# Altium schematic sheet Led_Master.SchDoc
size A3; SheetNumber: 1; SheetTotal: 1; SPICEModelCacheZWRPGDZJ: <root> / <DocumentId>ZWRPGDZJ</DocumentId> / </root>
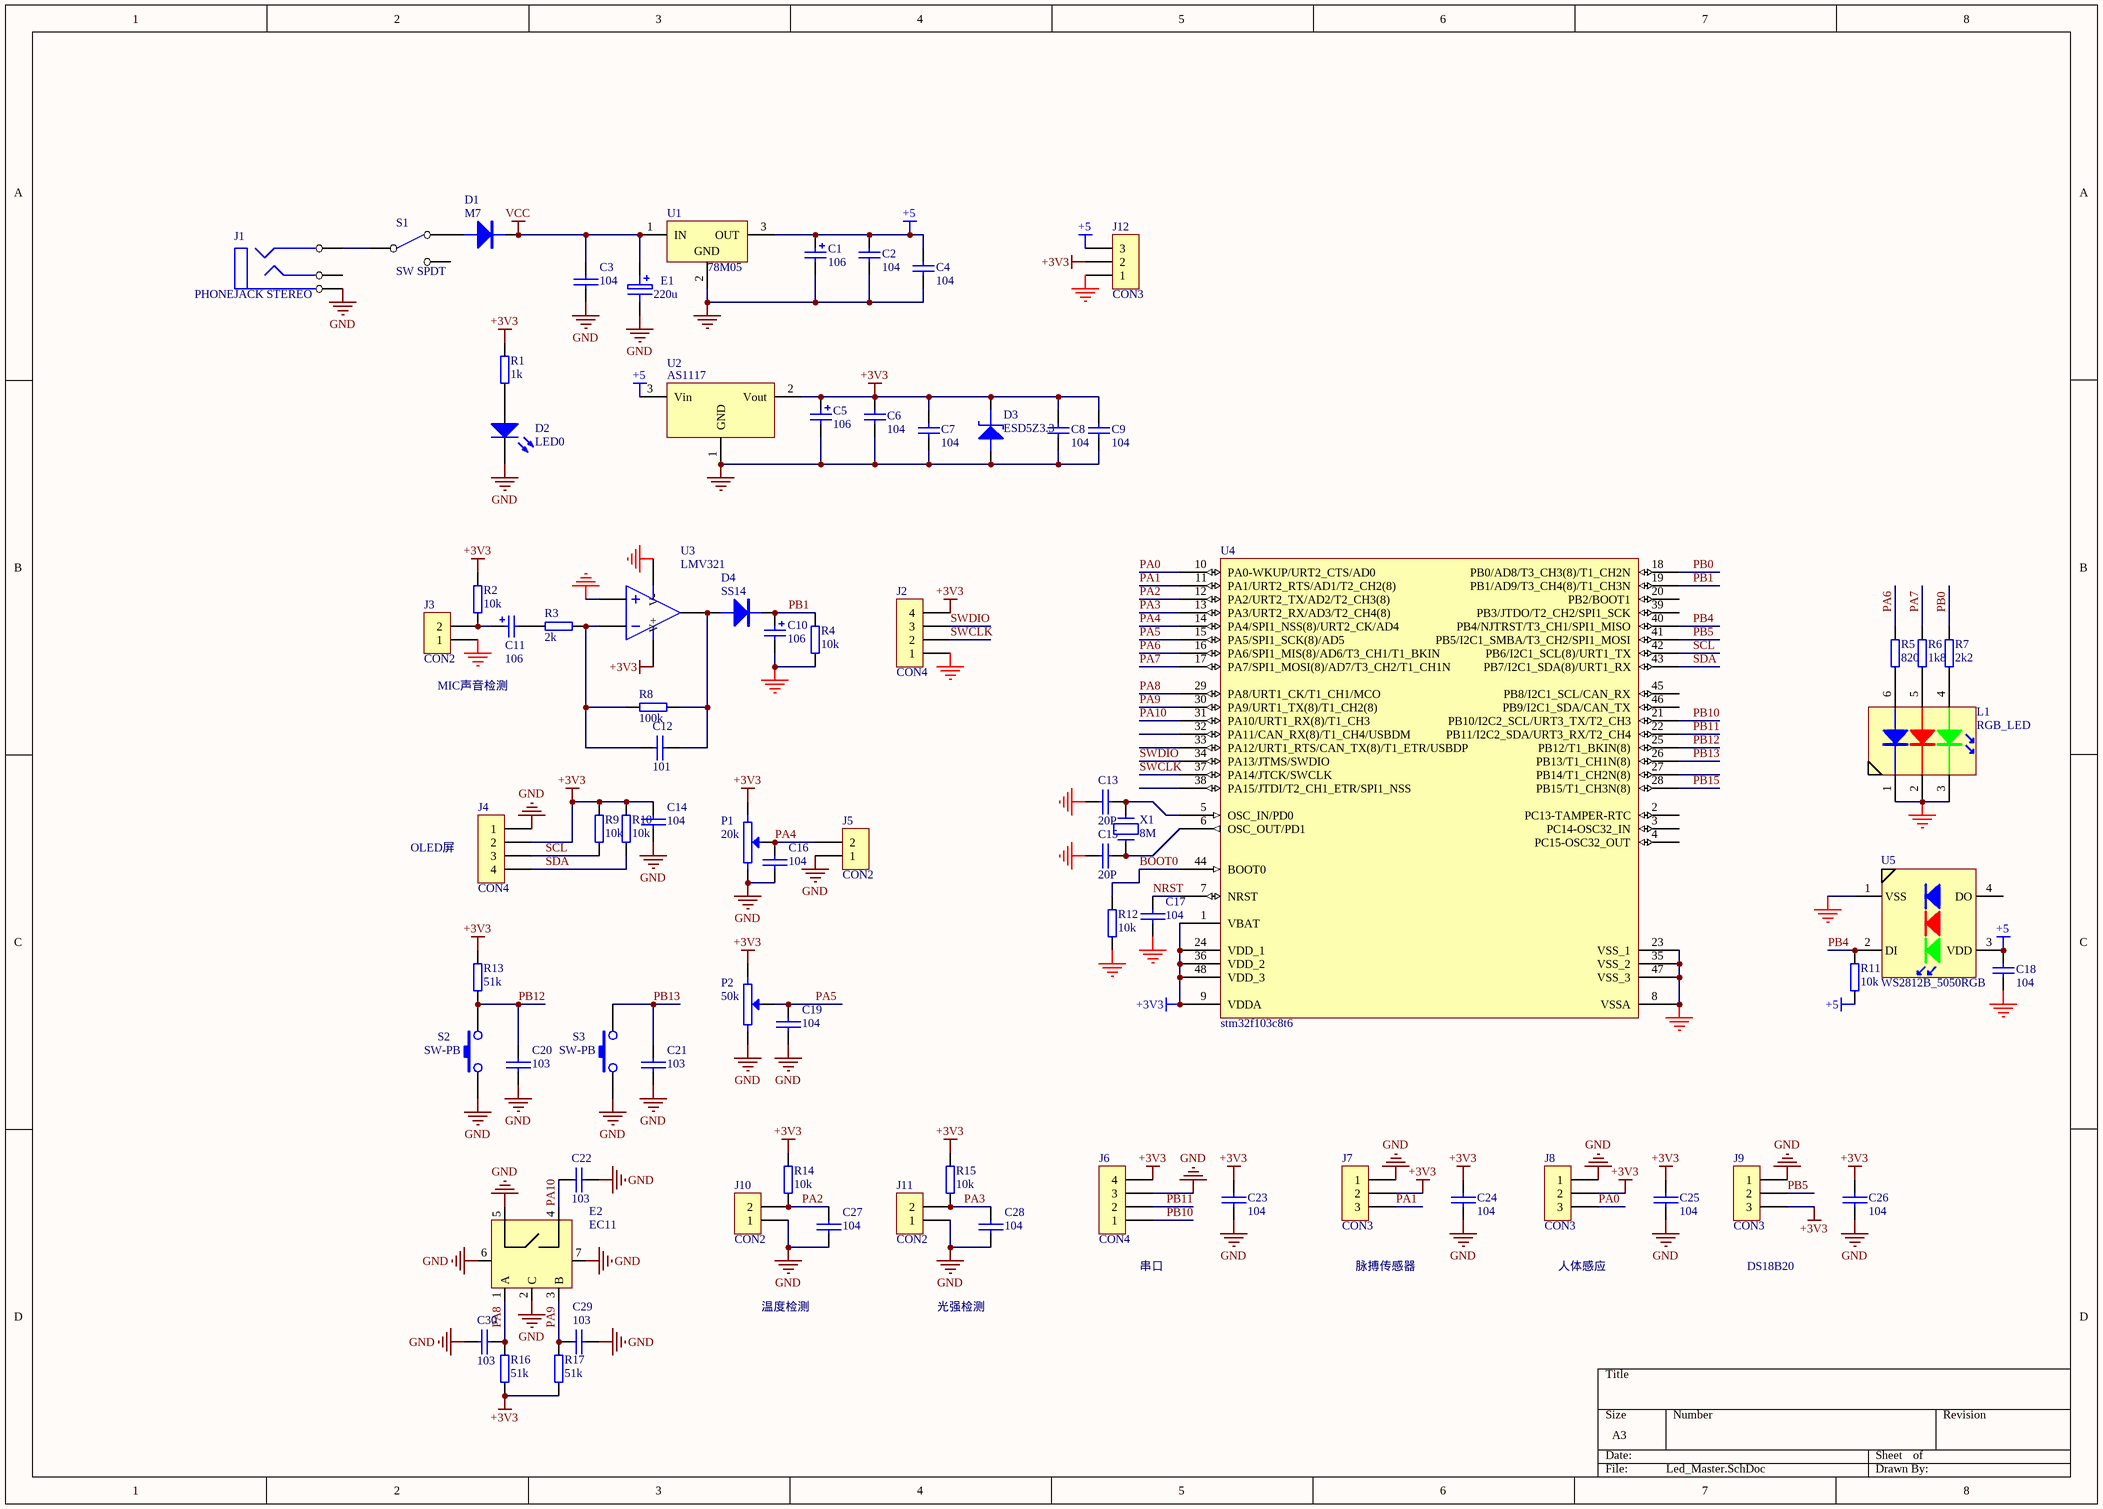
[diagram p0: Led_Master.SchDoc]

## Parts
C1  106  [0603C]
C2  104  [0603C]
C3  104  [0603c]
C4  104  [0603C]
C5  106  [0603C]
C6  104  [0603C]
C7  104  [0603C]
C8  104  [0603C]
C9  104  [0603C]
C10  106  [0603C]
C11  106  [0603C]
C12  101  [0603c]
C13  20P  [0603c]
C14  104  [0603c]
C15  20P  [0603c]
C16  104  [0603c]
C17  104  [0603c]
C18  104  [0603C]
C19  104  [0603c]
C20  103  [0603c]
C21  103  [0603c]
C22  103  [0603c]
C23  104  [0603c]
C24  104  [0603c]
C25  104  [0603c]
C26  104  [0603c]
C27  104  [0603c]
C28  104  [0603c]
C29  103  [0603c]
C30  103  [0603c]
D1  M7  [DO214_SMA]
D2  LED0  [LED_0805_R]
D3  ESD5Z3.3  [SOD323]
D4  SS14  [SOD123]
E1  220u  [CAP_PR_2.5_8]
E2  EC11  [SW_EC11]
J1  PHONEJACK STEREO  [内径5.5插座]
J2  CON4  [SIP4]
J3  CON2  [SIP02]
J4  CON4  [OLED 1.3寸屏]
J5  CON2  [SIP02]
J6  CON4  [XH_2.54_4P]
J7  CON3  [SIP03]
J8  CON3  [SIP03]
J9  CON3  [SIP03]
J10  CON2  [SIP02]
J11  CON2  [SIP02]
J12  CON3  [SIP03]
L1  RGB_LED  [LED_5050]
P1  20k  [RV0932]
P2  50k  [RV0932]
R1  1k  [0603r]
R2  10k  [0603r]
R3  2k  [0603r]
R4  10k  [0603r]
R5  820  [0603r]
R6  1k8  [0603r]
R7  2k2  [0603r]
R8  100k  [0603r]
R9  10k  [0603r]
R10  10k  [0603r]
R11  10k  [0603r]
R12  10k  [0603r]
R13  51k  [0603r]
R14  10k  [0603r]
R15  10k  [0603r]
R16  51k  [0603r]
R17  51k  [0603r]
S1  SW SPDT  [SS12D10直脚拨动开关]
S2  SW-PB  [SW_PB_6X6]
S3  SW-PB  [SW_PB_6X6]
U1  78M05  [TO-252AA]
U2  AS1117  [SOT223]
U3  LMV321  [SOT23_5]
U4  stm32f103c8t6  [LQFP_48_7X7]
U5  WS2812B_5050RGB  [LED_5050]
X1  8M  [CAPM5032X12N]

## Nets
+3V3: C5.1 C6.1 C7.1 C8.1 C9.1 C14.1 C23.2 C24.2 C25.2 C26.2 D3.2(K) J2.4 J4.2 J6.4 J7.2 J8.2 J9.3 J12.2 P1.2 P2.2 R1.2 R2.2 R9.2 R10.2 R13.2 R14.2 R15.2 R16.1 R17.1 U2.2(Vout) U3.4(V+) U4.1(VBAT) U4.9(VDDA) U4.24(VDD_1) U4.36(VDD_2) U4.48(VDD_3)
+5: C1.1 C2.1 C4.1 C18.1 J12.3 R11.2 U1.3(OUT) U2.3(Vin) U5.3(VDD)
GND: C1.2 C2.2 C3.2 C4.2 C5.2 C6.2 C7.2 C8.2 C9.2 C10.2 C13.1 C14.2 C15.1 C16.2 C17.2 C18.2 C19.2 C20.2 C21.2 C22.2 C23.1 C24.1 C25.1 C26.1 C27.2 C28.2 C29.2 C30.1 D2.2(K) D3.1(A) E1.2 E2.2(C) E2.5 E2.6 E2.7 J1.3(C) J2.1 J3.1 J4.1 J5.1 J6.3 J7.1 J8.1 J9.1 J10.1 J11.1 J12.1 L1.1 L1.2 L1.3 P1.1 P2.1 R4.1 R12.1 S2.1 S3.1 U1.2(GND) U2.1(GND) U3.2(IN+) U3.5(V-) U4.8(VSSA) U4.23(VSS_1) U4.35(VSS_2) U4.47(VSS_3) U5.1(VSS)
VCC: C3.1 D1.2(K) E1.1 U1.1(IN)
BOOT0: R12.2 U4.44(BOOT0)
NRST: C17.1 U4.7(NRST)
PA0: J8.3 U4.10(PA0-WKUP/URT2_CTS/AD0)
PA1: J7.3 U4.11(PA1/URT2_RTS/AD1/T2_CH2(8))
PA2: C27.1 J10.2 R14.1 U4.12(PA2/URT2_TX/AD2/T2_CH3(8))
PA3: C28.1 J11.2 R15.1 U4.13(PA3/URT2_RX/AD3/T2_CH4(8))
PA4: C16.1 J5.2 P1.3(W) U4.14(PA4/SPI1_NSS(8)/URT2_CK/AD4)
PA5: C19.1 P2.3(W) U4.15(PA5/SPI1_SCK(8)/AD5)
PA6: R5.2 U4.16(PA6/SPI1_MIS(8)/AD6/T3_CH1/T1_BKIN)
PA7: R6.2 U4.17(PA7/SPI1_MOSI(8)/AD7/T3_CH2/T1_CH1N)
PA8: C30.2 E2.1(A) R16.2 U4.29(PA8/URT1_CK/T1_CH1/MCO)
PA9: C29.1 E2.3(B) R17.2 U4.30(PA9/URT1_TX(8)/T1_CH2(8))
PA10: C22.1 E2.4 U4.31(PA10/URT1_RX(8)/T1_CH3)
PB0: R7.2 U4.18(PB0/AD8/T3_CH3(8)/T1_CH2N)
PB1: C10.1 D4.2(K) R4.2 U4.19(PB1/AD9/T3_CH4(8)/T1_CH3N)
PB4: R11.1 U4.40(PB4/NJTRST/T3_CH1/SPI1_MISO) U5.2(DI)
PB5: J9.2 U4.41(PB5/I2C1_SMBA/T3_CH2/SPI1_MOSI)
PB10: J6.1 U4.21(PB10/I2C2_SCL/URT3_TX/T2_CH3)
PB11: J6.2 U4.22(PB11/I2C2_SDA/URT3_RX/T2_CH4)
PB12: C20.1 R13.1 S2.2 U4.25(PB12/T1_BKIN(8))
PB13: C21.1 S3.2 U4.26(PB13/T1_CH1N(8))
PB15: U4.28(PB15/T1_CH3N(8))
SCL: J4.3 R9.1 U4.42(PB6/I2C1_SCL(8)/URT1_TX)
SDA: J4.4 R10.1 U4.43(PB7/I2C1_SDA(8)/URT1_RX)
SWCLK: J2.2 U4.37(PA14/JTCK/SWCLK)
SWDIO: J2.3 U4.34(PA13/JTMS/SWDIO)
NetC11_1: C11.1 J3.2 R2.1
NetC11_2: C11.2 R3.1
NetC12_1: C12.1 D4.1(A) R8.1 U3.3(OUT)
NetC12_2: C12.2 R3.2 R8.2 U3.1(IN-)
NetC13_2: C13.2 U4.5(OSC_IN/PD0) X1.2
NetC15_2: C15.2 U4.6(OSC_OUT/PD1) X1.1
NetD1_1: D1.1(A) S1.2(NC)
NetD2_1: D2.1(A) R1.1
NetJ1_1: J1.1(A) S1.1(COMMON)
NetL1_4: L1.4 R7.1
NetL1_5: L1.5 R6.1
NetL1_6: L1.6 R5.1

Not connected (* = marked no-connect by the designer): J1 2(B); L1 A(1); S1 3(NO); U4 2(PC13-TAMPER-RTC) 3(PC14-OSC32_IN) 4(PC15-OSC32_OUT) 20(PB2/BOOT1) 27(PB14/T1_CH2N(8)) 32(PA11/CAN_RX(8)/T1_CH4/USBDM) 33(PA12/URT1_RTS/CAN_TX(8)/T1_ETR/USBDP) 38(PA15/JTDI/T2_CH1_ETR/SPI1_NSS) 39(PB3/JTDO/T2_CH2/SPI1_SCK) 45(PB8/I2C1_SCL/CAN_RX) 46(PB9/I2C1_SDA/CAN_TX); U5 4(DO) A(1)

## Notes on the sheet
- MIC声音检测
- OLED屏
- 温度检测
- 光强检测
- (near J6) 串口
- 脉搏传感器
- 人体感应
- DS18B20

## Library data of the parts
C1 C5 C10 C11 = Cap Pol1: Polarized Capacitor (Radial); Value: 10uF; Published: 8-Jun-2000; Revision: July-2002: Re-released for DXP Platform.; Publisher: Altium Limited
C2 C4 C6-C9 C18 = Cap: Capacitor; Value: 10nF; Published: 8-Jun-2000; Revision: July-2002: Re-released for DXP Platform.; Publisher: Altium Limited
C3 C14 C16 C19-C22 C27-C30 = Pro14.tmp_104_7
C12 C17 C23-C26 = CAP: Capacitor
C13 C15 = Pro87.tmp_22p_18
D1 D4 = DIODE
D2 = LED0: Typical INFRARED GaAs LED; pin to pad: 1>2 2>1; Published: 8-Jun-2000; LatestRevisionDate: 08-Jul-2005; LatestRevisionNote: Mech Layer 1 removed.; PackageReference: LED-0; Publisher: Altium Limited
D3 = ZENER2: Zener Diode
E1 = Pro87.tmp_47u_10
E2 = EC11编码开关: pin to pad: 6>H1 7>H2
J1 = PHONEJACK STEREO: pin to pad: 2>3 3>2
J2 J4 J6 = CON4: Connector
J3 J5 J10 J11 = CON2: Connector
J7-J9 J12 = CON3: Connector
P1 P2 = POT2: Potentiometer; pin to pad: 2>3 3>2
R1-R17 = RES2
U1 = LP2950CDT-5.0: Series of Adjustable Micropower Voltage Regulators; Manufacturer: National Semiconductor; CompType: LDO IC; PackageTopMarking: NSUZXYTT*LP2950*CDT-5.0; PowerWise: N; Published: 4-Dec-2008; DatasheetVersion: May-2005; PackageVersion: revC, Apr-2003; PackageReference: TD03B; Publisher: Altium Limited; PackageDescription: TO252, Molded, Jedec, 6.8 x 6.10 x 2.30mm Body, 3 Lead, 2.28mm Pitch, Surface Mount; PartNumber: LP2950CDT-5.0; RoHS: O; PinCount: 3; DigiKeyPartNumber: LP2950CDT-5.0NS-ND; Code_JEDEC: TO-252-AA; ComponentLink1Description: LP2950 Datasheet; ComponentLink1URL: http://www.national.com/ds/LP/LP2950.pdf; ComponentLink2Description: LP2950 Web Page; ComponentLink2URL: http://www.national.com/pf/LP/LP2950.html; ComponentLink3Description: TD03B Package Page; ComponentLink3URL: http://www.national.com/packaging/folders/td03b.html
U2 = VOLTREG1
U3 = OPAMP: Operational Amplifier; pin to pad: 1>3 2>1 3>4 4>5 5>2
U4 = stm32f103_48p
U5 = WS2812B_5050RGB: pin to pad: 2>3 3>4 4>6
X1 = Pro87.tmp_8M_17